# Altium schematic sheet DAC_Filter.SchDoc: =ProjectName
size 420 x 297 mm; Author: SBH; CompanyName: WUT; DrawnBy: SBH; Organization: ISE-WUT; Address1: Warsaw Univeristy of Technology; Address2: Nowowiejska 15/19; Revision: -; SheetNumber: -; SheetTotal: -; EDA_Number: ARTIQ; Projet: ADC/DAC MEZZANINE; ModifiedBy: -; CreateDate: XX/XX/XXXX; CheckedDate: -; Title2: DAC_Filter.SchDoc; DivGrp: ISE; Designer: SBH; ModifiedDate: -; ProjectName: ADC/DAC MEZZANINE
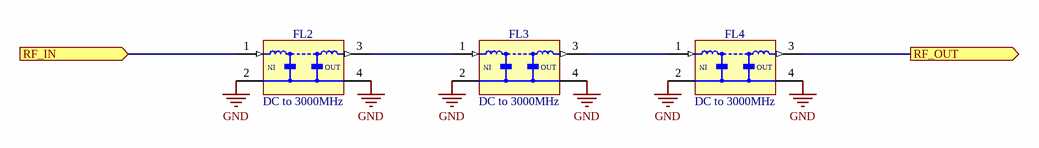
[diagram p0: DAC_Filter.SchDoc]

## Parts
FL2  DC to 3000MHz  [FIL_MINI-CIRCUITS_FV1206]
FL3  DC to 3000MHz  [FIL_MINI-CIRCUITS_FV1206]
FL4  DC to 3000MHz  [FIL_MINI-CIRCUITS_FV1206]

## Ports
RF_IN (in), RF_OUT (out)

## Nets
GND: FL2.2(GND) FL2.4(GND) FL3.2(GND) FL3.4(GND) FL4.2(GND) FL4.4(GND)
RF_IN: FL2.1(RFIN) ; port RF_IN
RF_OUT: FL4.3(RFOUT) ; port RF_OUT
NetFL2_3: FL2.3(RFOUT) FL3.1(RFIN)
NetFL3_3: FL3.3(RFOUT) FL4.1(RFIN)

## Notes on the sheet
- Project/Equipment
- Designer
- Drawn by
- Check.by
- File
- Last Mod.
- Print Date
- Sheet
- Size
- A3
- of
- Rev
- (in symbol FIL_MINI-CIRCUITS_LFCN-3000+) IN; OUT

## Library data of the parts
FL2-FL4 = FIL_MINI-CIRCUITS_LFCN-3000+: 50 Ohm DC to 3000MHz Low Pass Filter; Part Description: 50 Ohm Low Pass Filter; Part Number: FIL_MINI-CIRCUITS_LFCN-3000+; Component Kind: Standard; Component Type: Standard; Pin Count: 2; Value: DC to 3000MHz; Status: None; Manufacturer: MINI-CIRCUITS; Manufacturer Part Number: LFCN-3000+; Mounted: Yes; Socket: No; SMD: Yes; Sense: No; ComponentHeight: 0.94mm; HelpURL: \\cern.ch\dfs\Applications\Altium\Datasheets\FIL_MINI-CIRCUITS_LFCN-3000+.pdf; Author: CERN DEM JLC; CreateDate: 2013-12-09; LatestRevisionDate: 2013-12-09